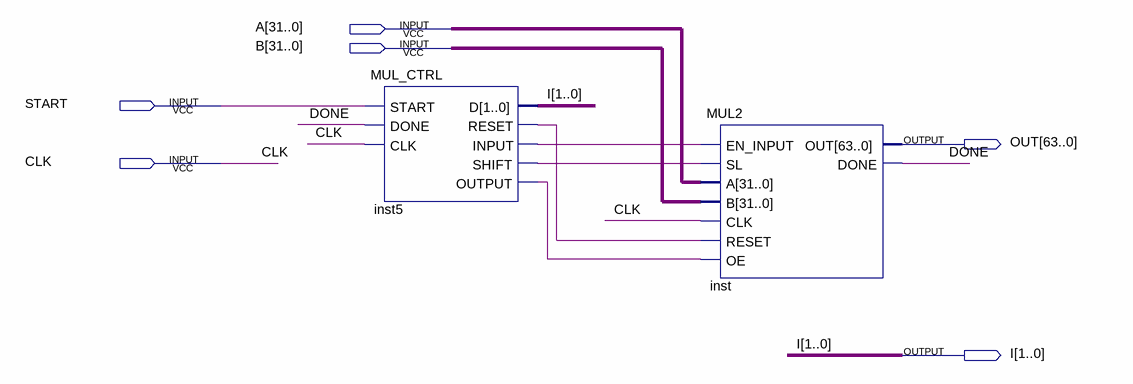
[diagram p0: schematic sheet]
// Quartus schematic MUL2wCTRL.bdf as structural Verilog: 2 symbols, 6 pins
module MUL2wCTRL (
  input  [31:0] A,
  input  [31:0] B,
  input  START,
  input  CLK,
  output [63:0] OUT,
  output [1:0] I
);

  wire DONE, inst5_input, inst5_output, inst5_reset, inst5_shift;

  MUL_CTRL inst5 (
    .START(START), .DONE(DONE), .CLK(CLK), .D(I), .RESET(inst5_reset), .INPUT(inst5_input),
    .SHIFT(inst5_shift), .OUTPUT(inst5_output));
  MUL2 inst (
    .EN_INPUT(inst5_input), .SL(inst5_shift), .A(A), .B(B), .CLK(CLK), .RESET(inst5_reset),
    .OE(inst5_output), .OUT(OUT), .DONE(DONE));
endmodule
